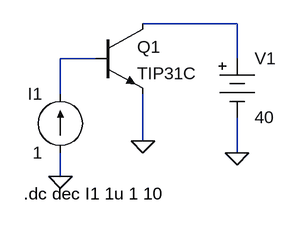
[diagram p0: schematic Draft1.asc]
Draft1.asc, the LTspice schematic file:
Version 4
SHEET 1 880 680
WIRE 304 32 176 32
WIRE 112 80 64 80
WIRE 304 80 304 32
WIRE 64 128 64 80
WIRE 176 192 176 128
WIRE 304 208 304 160
WIRE 64 240 64 208
FLAG 64 240 0
FLAG 176 192 0
FLAG 304 208 0
SYMBOL current 64 208 R180
WINDOW 0 24 80 Left 2
WINDOW 3 24 0 Left 2
WINDOW 123 0 0 Left 0
WINDOW 39 0 0 Left 0
SYMATTR InstName I1
SYMATTR Value 1
SYMBOL npn 112 32 R0
SYMATTR InstName Q1
SYMATTR Value TIP31C
SYMBOL Misc\\battery 304 64 R0
WINDOW 123 0 0 Left 0
WINDOW 39 0 0 Left 0
SYMATTR InstName V1
SYMATTR Value 40
TEXT 14 264 Left 2 !.dc dec I1 1u 1 10

The netlist it stands for:
* Draft1.asc
I1 0 N002 1
Q1 N001 N002 0 0 TIP31C
V1 N001 0 40
.model NPN NPN
.model PNP PNP
.lib standard.bjt
.dc dec I1 1u 1 10
.backanno
.end